# EAGLE schematic analogTCO-RJ-alone (EAGLE 6.6.0)
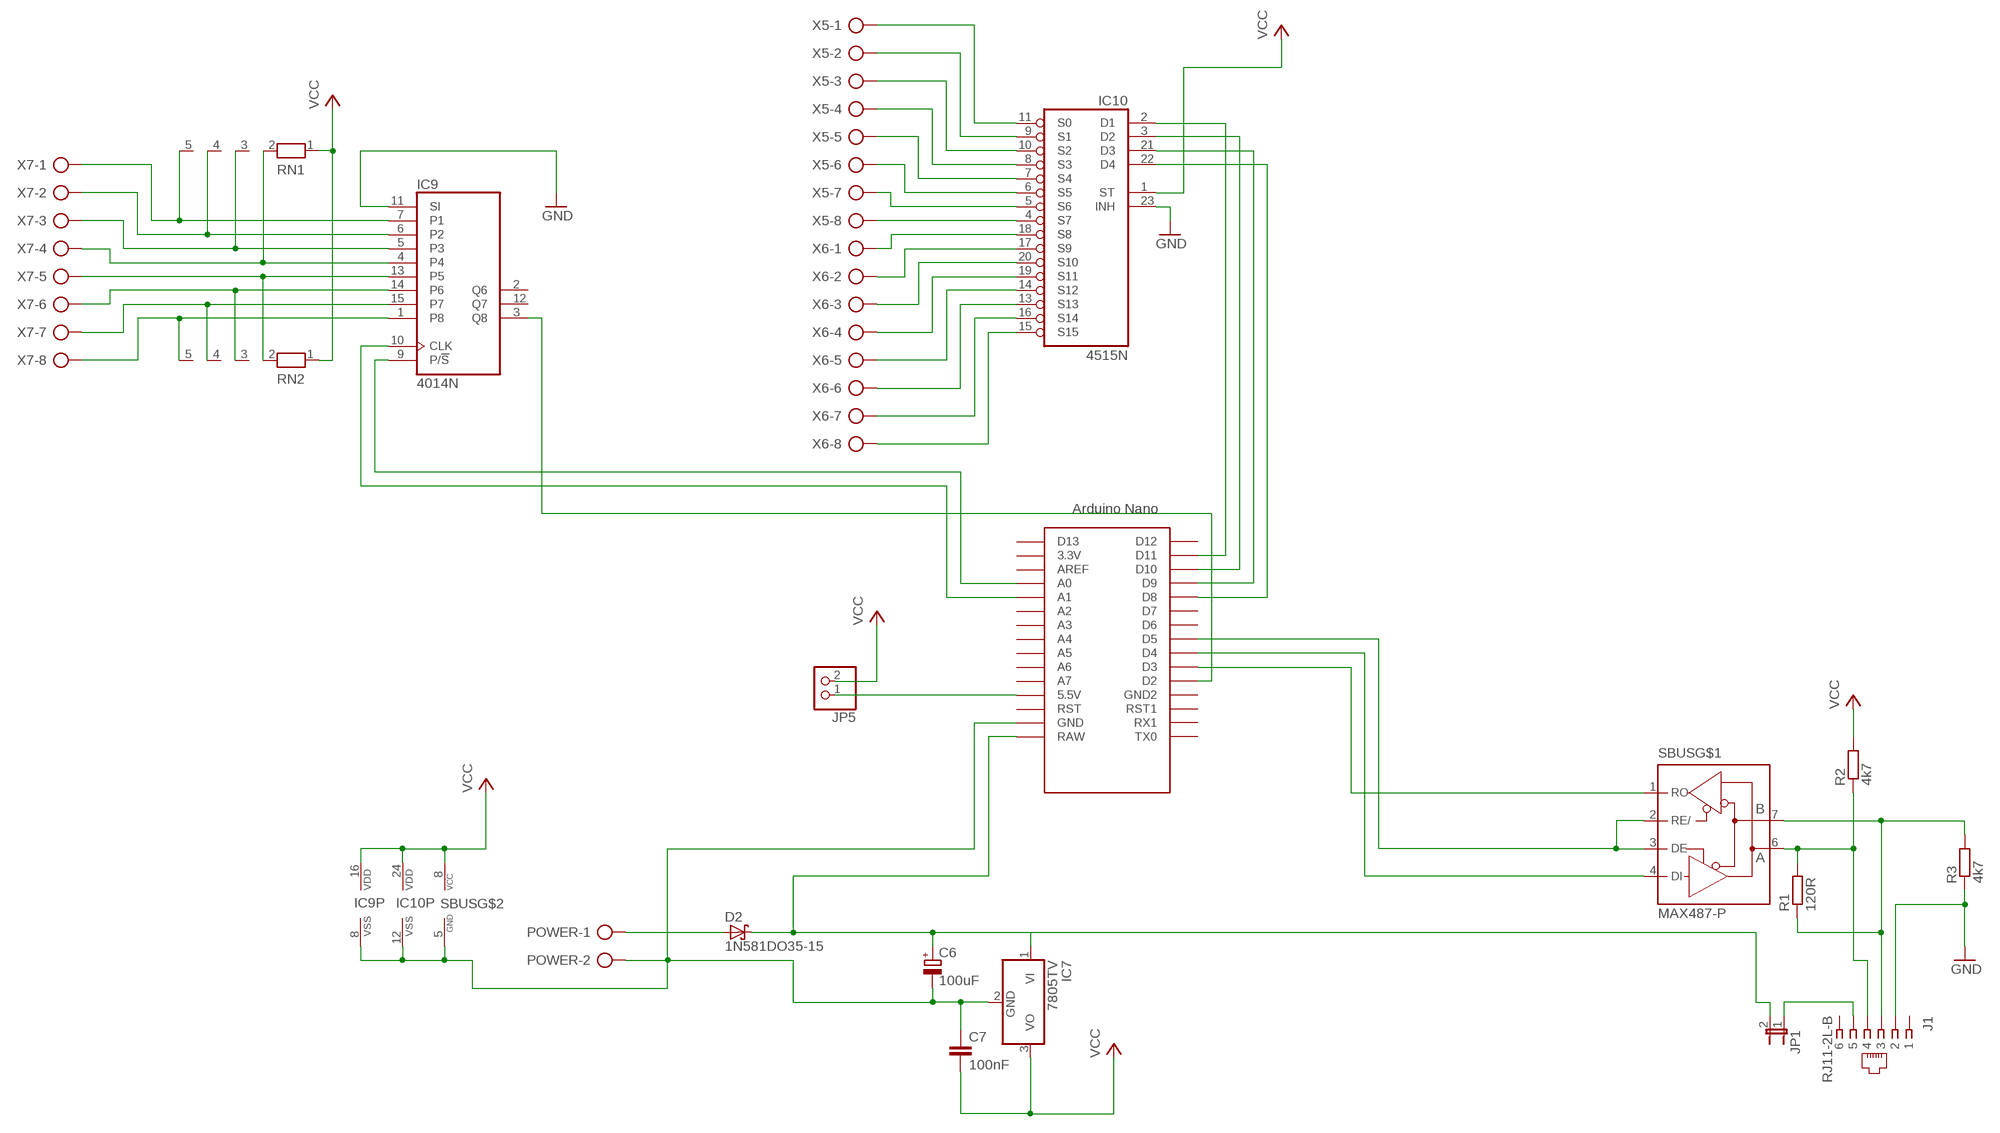
[diagram p0: schematic, sheet 1]

## Parts
C6  100uF  CPOL-EUE2.5-6  [E2,5-6]
C7  100nF  C-EU025-025X050  [C025-025X050]
D2  1N581DO35-15  [DO35-10]
IC7  7805TV  [TO220V]
IC9  4014N  [DIL16]
IC10  4515N  [DIL24-6]
J1  RJ11-2L-B  [RJ11-NO_SHIELD]
JP1  JP1E  [JP1]
JP5  PINHD-1X2  [1X02]
POWER  AK500/2  [AK500/2]
R1  120R  R-EU_0207/12  [0207/12]
R2  4k7  R-EU_0207/12  [0207/12]
R3  4k7  R-EU_0207/12  [0207/12]
RN1  RN04  [RN-5]
RN2  RN04  [RN-5]
SBUS  MAX487-P  [DIL08]
U$1  NANO  [NANO]
X5  AK500/8  [AK500/8]
X6  AK500/8  [AK500/8]
X7  AK500/8  [AK500/8]

## Nets
+12V: C6.+ D2.C IC7.1(VI) JP1.2 U$1.RAW
GND: C6.- C7.1 IC7.2(GND) IC9.8(VSS) IC9.11(SI) IC10.12(VSS) IC10.23(INH) J1.2 POWER.2 R3.1 SBUS.5(GND) U$1.GND
N$1: SBUS.2(RE/) SBUS.3(DE) U$1.D5
N$2: SBUS.1(RO) U$1.D3
N$3: SBUS.4(DI) U$1.D4
N$4: J1.4 R1.2 R2.1 SBUS.6(A)
N$5: J1.3 R1.1 R3.2 SBUS.7(B)
N$6: JP5.1 U$1.5V(5.5V)
N$8: J1.5 JP1.1
N$26: IC10.3(D2) U$1.D10
N$27: IC10.2(D1) U$1.D11
N$70: IC9.9(P/!S) U$1.A0
N$71: IC9.10(CLK) U$1.A1
N$73: IC9.3(Q8) U$1.D2
N$74: IC10.11(S0) X5.1
N$75: IC10.9(S1) X5.2
N$76: IC10.10(S2) X5.3
N$77: IC10.8(S3) X5.4
N$78: IC10.7(S4) X5.5
N$79: IC10.6(S5) X5.6
N$80: IC10.5(S6) X5.7
N$81: IC10.4(S7) X5.8
N$82: IC10.18(S8) X6.1
N$83: IC10.17(S9) X6.2
N$84: IC10.20(S10) X6.3
N$85: IC10.19(S11) X6.4
N$86: IC10.14(S12) X6.5
N$87: IC10.13(S13) X6.6
N$88: IC10.16(S14) X6.7
N$89: IC10.15(S15) X6.8
N$90: IC9.7(P1) RN1.5 X7.1
N$91: IC9.6(P2) RN1.4 X7.2
N$92: IC9.5(P3) RN1.3 X7.3
N$93: IC9.4 RN1.2 X7.4
N$94: IC9.13(P5) RN2.2 X7.5
N$95: IC9.14(P6) RN2.3 X7.6
N$96: IC9.15(P7) RN2.4 X7.7
N$97: IC9.1(P8) RN2.5 X7.8
N$98: IC10.21(D3) U$1.D9
N$99: IC10.22(D4) U$1.D8
N$109: D2.A POWER.1
VCC: C7.2 IC7.3(VO) IC9.16(VDD) IC10.1(ST) IC10.24(VDD) JP5.2 R2.2 RN1.1 RN2.1 SBUS.8(VCC)
Unconnected: IC9.2(Q6) IC9.12(Q7) J1.1 J1.6 U$1.3.3V U$1.A2 U$1.A3 U$1.A4 U$1.A5 U$1.A6 U$1.A7 U$1.AREF U$1.D6 U$1.D7 U$1.D12 U$1.D13 U$1.GND1(GND2) U$1.ICSP1 U$1.ICSP2 U$1.ICSP3 U$1.ICSP4 U$1.ICSP5 U$1.ICSP6 U$1.RST U$1.RST1 U$1.RX1 U$1.TX0

## Library data of the parts
C6 = resistor:CPOL-EU: POLARIZED CAPACITOR, European symbol
C7 = rcl:C-EU: CAPACITOR, European symbol
D2 = custom:1N581*: 1.0A SCHOTTKY BARRIER RECTIFIER Source: http://www.diodes.com/datasheets/ds23001.pdf
IC7 = linear:78*: Positive VOLTAGE REGULATOR Source: http://cache.national.com/ds/LM/LM78L05.pdf http://www.fairchildsemi.com/ds/LM/LM7805.pdf
IC9 = 40xx:4014: 8-bit static SHIFT REGISTER
IC10 = 45xx:4515: 4-bit latch 4-16 line DECODER
J1 = con-tycoelectronics:RJ11: CORCOM Modular RJ Jacks No Shield Source: www.tycoelectronics.com .. ENG_DS_1654001_1099_RJ_L_0507.pdf; MF: TYCO ELECTRONICS; MPN: RJ11-2L-B; OC_FARNELL: unknown; OC_NEWARK: 83F4463
JP1 = jumper:JP1E: JUMPER
JP5 = pinhead:PINHD-1X2: PIN HEADER
POWER = con-ptr500:AK500/2: CONNECTOR; OC_FARNELL: unknown; OC_NEWARK: unknown
R1-R3 = resistor:R-EU_: RESISTOR, European symbol
RN1 RN2 = resistor-net:RN04: RESISTOR NETWORK; OC_FARNELL: unknown; OC_NEWARK: unknown
SBUS = rs232-rs485:MAX487: RS485 TRANSEIVER
U$1 = Arduino-clone:NANO: Arduino Nano
X5-X7 = con-ptr500:AK500/8: CONNECTOR; OC_FARNELL: unknown; OC_NEWARK: unknown